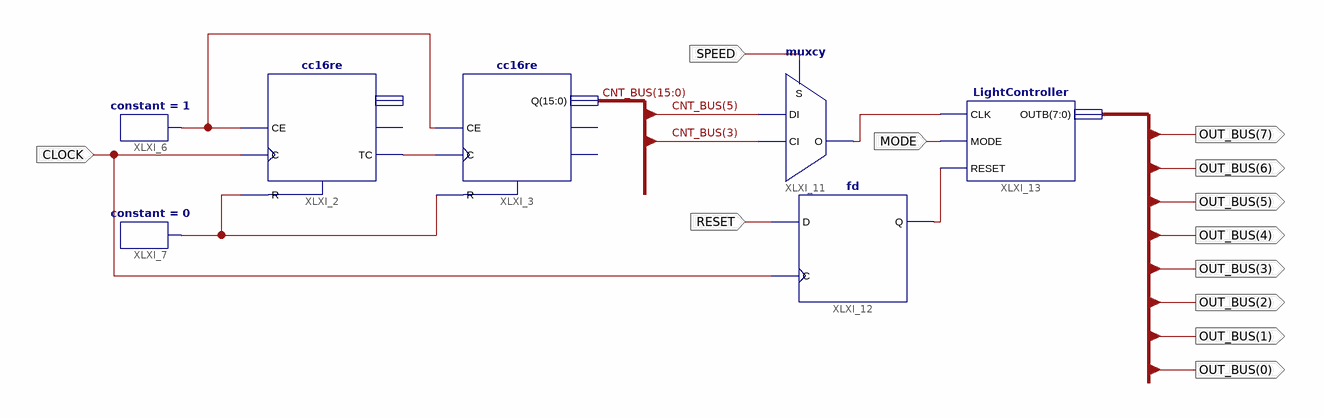
[diagram p0: schematic sheet 1]
// Xilinx ISE schematic TopLevel.sch (spartan3a) as structural Verilog: 7 symbols, 12 ports
module TopLevel (
  input  SPEED,
  input  RESET,
  input  CLOCK,
  input  MODE,
  output [7:0] OUT_BUS
);

  wire XLXN_1, XLXN_5, XLXN_12, XLXN_17, XLXN_20;
  wire [15:0] CNT_BUS;

  cc16re XLXI_2 (.C(CLOCK), .CE(XLXN_12), .R(XLXN_5), .TC(XLXN_1));  // open: CEO, Q
  cc16re XLXI_3 (.C(XLXN_1), .CE(XLXN_12), .R(XLXN_5), .Q(CNT_BUS));  // open: CEO, TC
  constant #(.CValue("0")) XLXI_7 (.O(XLXN_5));
  constant #(.CValue("1")) XLXI_6 (.O(XLXN_12));
  muxcy XLXI_11 (.CI(CNT_BUS[3]), .DI(CNT_BUS[5]), .S(SPEED), .O(XLXN_17));
  LightController XLXI_13 (.CLK(XLXN_17), .MODE(MODE), .RESET(XLXN_20), .OUTB(OUT_BUS));
  fd XLXI_12 (.C(CLOCK), .D(RESET), .Q(XLXN_20));
endmodule
